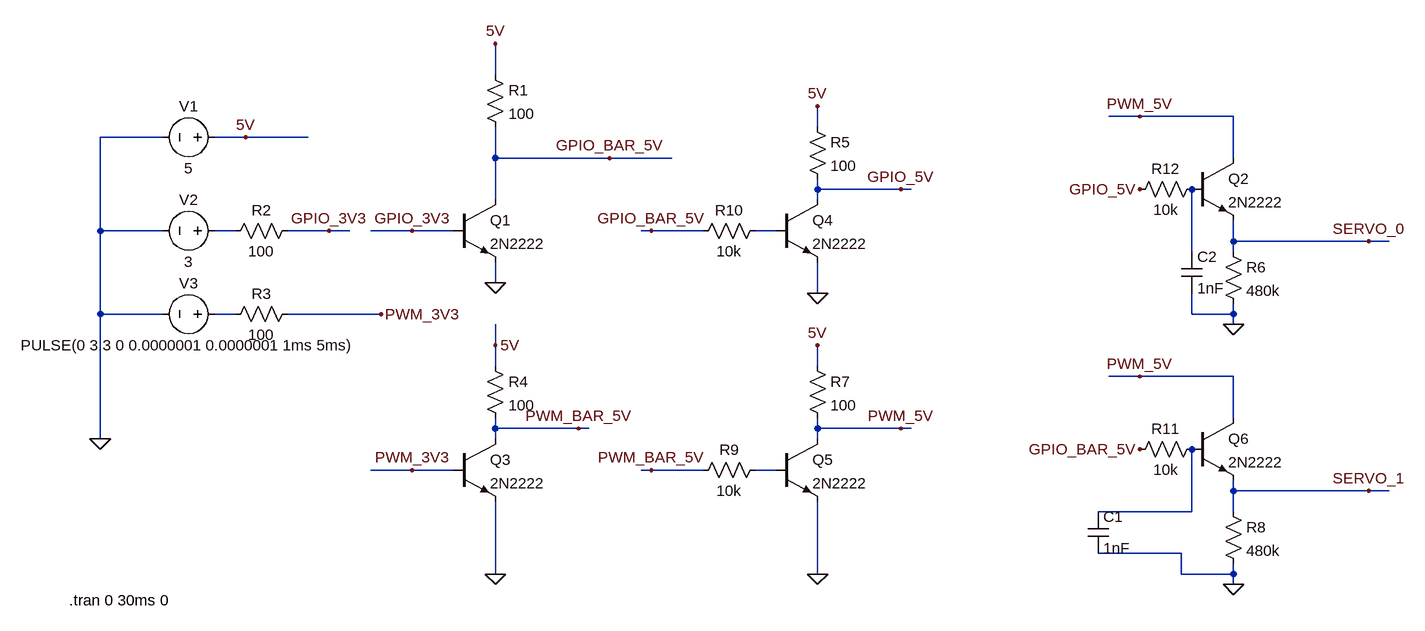
[diagram p0: schematic main.asc]
main.asc, the LTspice schematic file:
Version 4
SHEET 1 1552 680
WIRE 112 -352 112 -400
WIRE 1104 -288 1056 -288
WIRE 1248 -288 1104 -288
WIRE 608 -272 608 -304
WIRE -400 -256 -496 -256
WIRE -272 -256 -320 -256
WIRE -176 -256 -272 -256
WIRE 112 -224 112 -272
WIRE 288 -224 112 -224
WIRE 384 -224 288 -224
WIRE 1248 -224 1248 -288
WIRE 608 -176 608 -192
WIRE 736 -176 608 -176
WIRE 752 -176 736 -176
WIRE 112 -160 112 -224
WIRE 608 -160 608 -176
WIRE -496 -112 -496 -256
WIRE -400 -112 -496 -112
WIRE -288 -112 -320 -112
WIRE -144 -112 -208 -112
WIRE -112 -112 -144 -112
WIRE -16 -112 -80 -112
WIRE 48 -112 -16 -112
WIRE 352 -112 336 -112
WIRE 432 -112 352 -112
WIRE 544 -112 512 -112
WIRE 1248 -96 1248 -128
WIRE 1456 -96 1248 -96
WIRE 1488 -96 1456 -96
WIRE 1184 -80 1184 -176
WIRE 1248 -80 1248 -96
WIRE 112 -32 112 -64
WIRE 608 -16 608 -64
WIRE -496 16 -496 -112
WIRE -400 16 -496 16
WIRE -288 16 -320 16
WIRE -64 16 -208 16
WIRE 1184 16 1184 -16
WIRE 1248 16 1248 0
WIRE 1248 16 1184 16
WIRE 1248 32 1248 16
WIRE 112 64 112 32
WIRE 112 96 112 64
WIRE 608 96 608 64
WIRE 1104 112 1056 112
WIRE 1248 112 1104 112
WIRE 1248 176 1248 112
WIRE 112 192 112 176
WIRE 240 192 112 192
WIRE 256 192 240 192
WIRE 608 192 608 176
WIRE 736 192 608 192
WIRE 752 192 736 192
WIRE -496 208 -496 16
WIRE 112 208 112 192
WIRE 608 208 608 192
WIRE -16 256 -80 256
WIRE 48 256 -16 256
WIRE 352 256 336 256
WIRE 432 256 352 256
WIRE 544 256 512 256
WIRE 1248 288 1248 272
WIRE 1456 288 1248 288
WIRE 1488 288 1456 288
WIRE 1184 320 1184 224
WIRE 1184 320 1040 320
WIRE 1248 320 1248 288
WIRE 1168 384 1040 384
WIRE 112 416 112 304
WIRE 608 416 608 304
WIRE 1168 416 1168 384
WIRE 1248 416 1248 400
WIRE 1248 416 1168 416
WIRE 1248 432 1248 416
FLAG -496 208 0
FLAG -272 -256 5V
FLAG -144 -112 GPIO_3V3
FLAG 112 -400 5V
FLAG -16 -112 GPIO_3V3
FLAG 288 -224 GPIO_BAR_5V
FLAG 1104 -288 PWM_5V
FLAG 1104 -176 GPIO_5V
FLAG -64 16 PWM_3V3
FLAG 112 64 5V
FLAG -16 256 PWM_3V3
FLAG 112 416 0
FLAG 1248 32 0
FLAG 608 -304 5V
FLAG 608 -16 0
FLAG 736 -176 GPIO_5V
FLAG 352 256 PWM_BAR_5V
FLAG 608 416 0
FLAG 1104 112 PWM_5V
FLAG 1104 224 GPIO_BAR_5V
FLAG 1248 432 0
FLAG 736 192 PWM_5V
FLAG 240 192 PWM_BAR_5V
FLAG 608 64 5V
FLAG 352 -112 GPIO_BAR_5V
FLAG 112 -32 0
FLAG 1456 -96 SERVO_0
FLAG 1456 288 SERVO_1
SYMBOL voltage -304 -256 R90
WINDOW 0 -32 56 VBottom 2
WINDOW 3 32 56 VTop 2
WINDOW 123 0 0 Left 2
WINDOW 39 0 0 Left 2
SYMATTR InstName V1
SYMATTR Value 5
SYMBOL voltage -304 -112 R90
WINDOW 0 -32 56 VBottom 2
WINDOW 3 32 56 VTop 2
WINDOW 123 0 0 Left 2
WINDOW 39 0 0 Left 2
SYMATTR InstName V2
SYMATTR Value 3
SYMBOL voltage -304 16 R90
WINDOW 0 -32 56 VBottom 2
WINDOW 3 32 56 VTop 2
WINDOW 123 0 0 Left 2
WINDOW 39 0 0 Left 2
SYMATTR InstName V3
SYMATTR Value PULSE(0 3.3 0 0.0000001 0.0000001 1ms 5ms)
SYMBOL npn 48 -160 R0
SYMATTR InstName Q1
SYMATTR Value 2N2222
SYMBOL res 96 -368 R0
SYMATTR InstName R1
SYMATTR Value 100
SYMBOL npn 1184 -224 R0
SYMATTR InstName Q2
SYMATTR Value 2N2222
SYMBOL res -192 0 R90
WINDOW 0 0 56 VBottom 2
WINDOW 3 32 56 VTop 2
SYMATTR InstName R3
SYMATTR Value 100
SYMBOL npn 48 208 R0
SYMATTR InstName Q3
SYMATTR Value 2N2222
SYMBOL res 96 80 R0
SYMATTR InstName R4
SYMATTR Value 100
SYMBOL res 1232 -96 R0
SYMATTR InstName R6
SYMATTR Value 480k
SYMBOL res -192 -128 R90
WINDOW 0 0 56 VBottom 2
WINDOW 3 32 56 VTop 2
SYMATTR InstName R2
SYMATTR Value 100
SYMBOL npn 544 -160 R0
SYMATTR InstName Q4
SYMATTR Value 2N2222
SYMBOL res 592 -288 R0
SYMATTR InstName R5
SYMATTR Value 100
SYMBOL npn 544 208 R0
SYMATTR InstName Q5
SYMATTR Value 2N2222
SYMBOL res 592 80 R0
SYMATTR InstName R7
SYMATTR Value 100
SYMBOL npn 1184 176 R0
SYMATTR InstName Q6
SYMATTR Value 2N2222
SYMBOL res 1232 304 R0
SYMATTR InstName R8
SYMATTR Value 480k
SYMBOL res 528 -128 R90
WINDOW 0 0 56 VBottom 2
WINDOW 3 32 56 VTop 2
SYMATTR InstName R10
SYMATTR Value 10k
SYMBOL res 528 240 R90
WINDOW 0 0 56 VBottom 2
WINDOW 3 32 56 VTop 2
SYMATTR InstName R9
SYMATTR Value 10k
SYMBOL res 1200 208 R90
WINDOW 0 0 56 VBottom 2
WINDOW 3 32 56 VTop 2
SYMATTR InstName R11
SYMATTR Value 10k
SYMBOL res 1200 -192 R90
WINDOW 0 0 56 VBottom 2
WINDOW 3 32 56 VTop 2
SYMATTR InstName R12
SYMATTR Value 10k
SYMBOL cap 1024 320 R0
SYMATTR InstName C1
SYMATTR Value 1nF
SYMBOL cap 1168 -80 R0
SYMATTR InstName C2
SYMATTR Value 1nF
TEXT -544 456 Left 2 !.tran 0 30ms 0

The netlist it stands for:
* main.asc
V1 5V 0 5
V2 N001 0 3
V3 N004 0 PULSE(0 3.3 0 0.0000001 0.0000001 1ms 5ms)
Q1 GPIO_BAR_5V GPIO_3V3 0 0 2N2222
R1 5V GPIO_BAR_5V 100
Q2 PWM_5V N003 SERVO_0 0 2N2222
R3 PWM_3V3 N004 100
Q3 PWM_BAR_5V PWM_3V3 0 0 2N2222
R4 5V PWM_BAR_5V 100
R6 SERVO_0 0 480k
R2 GPIO_3V3 N001 100
Q4 GPIO_5V N002 0 0 2N2222
R5 5V GPIO_5V 100
Q5 PWM_5V N005 0 0 2N2222
R7 5V PWM_5V 100
Q6 PWM_5V N006 SERVO_1 0 2N2222
R8 SERVO_1 0 480k
R10 N002 GPIO_BAR_5V 10k
R9 N005 PWM_BAR_5V 10k
R11 N006 GPIO_BAR_5V 10k
R12 N003 GPIO_5V 10k
C1 N006 0 1nF
C2 N003 0 1nF
.model NPN NPN
.model PNP PNP
.lib standard.bjt
.tran 0 30ms 0
.backanno
.end